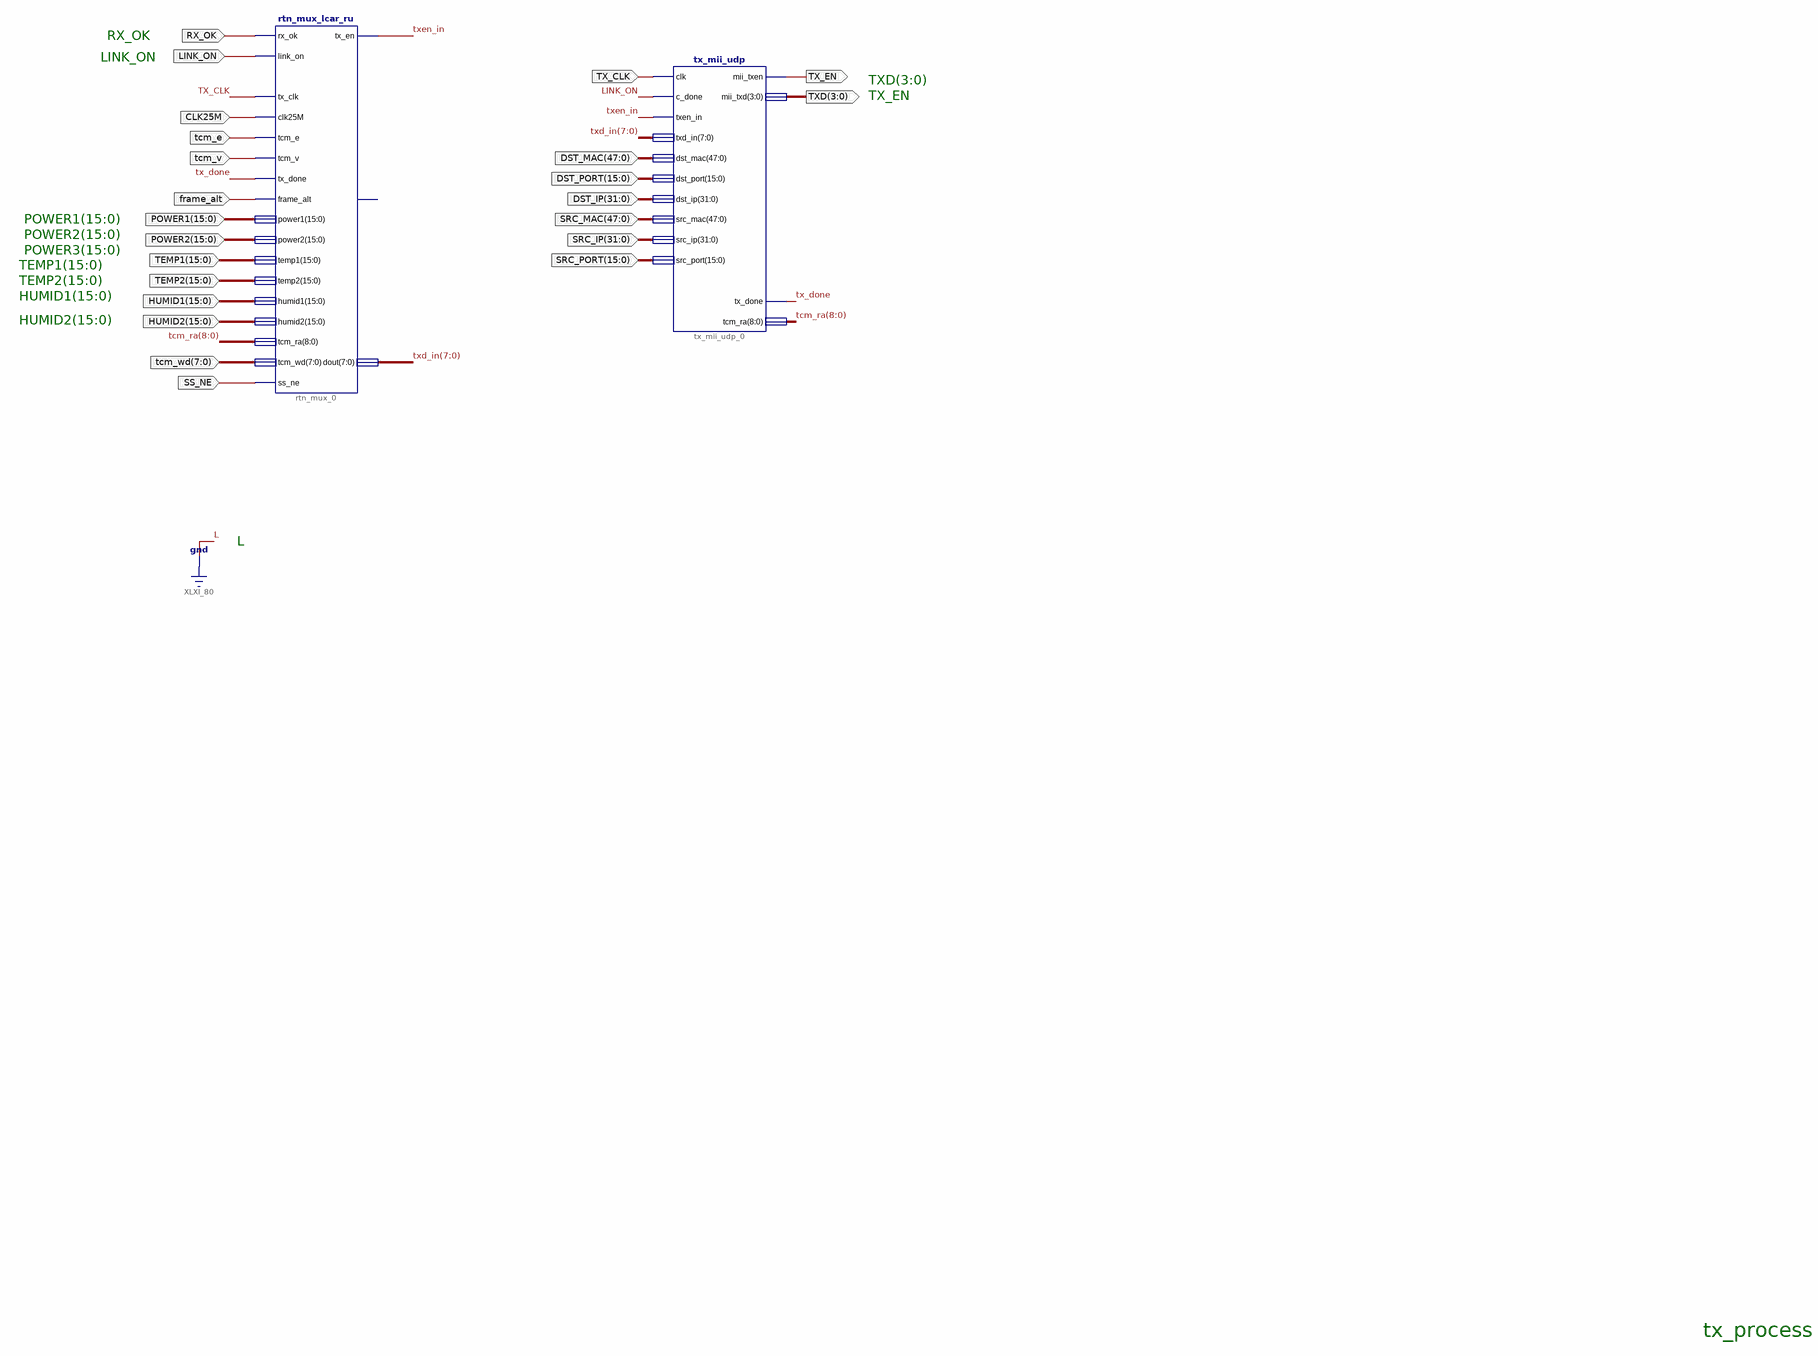
[diagram p0: schematic sheet 1]
// Xilinx ISE schematic tx_process.sch (aspartan6) as structural Verilog: 2 symbols, 23 ports
module tx_process (
  input  LINK_ON,
  input  TX_CLK,
  input  [47:0] DST_MAC,
  input  [15:0] DST_PORT,
  input  [31:0] DST_IP,
  input  [47:0] SRC_MAC,
  input  [31:0] SRC_IP,
  input  [15:0] SRC_PORT,
  input  [15:0] POWER1,
  input  RX_OK,
  input  CLK25M,
  input  [15:0] TEMP1,
  input  [15:0] TEMP2,
  input  [15:0] HUMID1,
  input  [15:0] HUMID2,
  input  tcm_e,
  input  tcm_v,
  input  frame_alt,
  input  [15:0] POWER2,
  input  [7:0] tcm_wd,
  input  SS_NE,
  output TX_EN,
  output [3:0] TXD
);

  wire tx_done, txen_in;
  wire [7:0] txd_in;
  wire [8:0] tcm_ra;

  tx_mii_udp tx_mii_udp_0 (
    .clk(TX_CLK), .c_done(LINK_ON), .txen_in(txen_in), .txd_in(txd_in), .dst_mac(DST_MAC),
    .dst_port(DST_PORT), .dst_ip(DST_IP), .src_mac(SRC_MAC), .src_ip(SRC_IP), .src_port(SRC_PORT),
    .mii_txen(TX_EN), .mii_txd(TXD), .tx_done(tx_done), .tcm_ra(tcm_ra));
  rtn_mux_lcar_ru rtn_mux_0 (
    .rx_ok(RX_OK), .link_on(LINK_ON), .tx_clk(TX_CLK), .clk25M(CLK25M), .tcm_e(tcm_e), .tcm_v(tcm_v),
    .tx_done(tx_done), .frame_alt(frame_alt), .power1(POWER1), .power2(POWER2), .temp1(TEMP1), .temp2(TEMP2),
    .humid1(HUMID1), .humid2(HUMID2), .tcm_ra(tcm_ra), .tcm_wd(tcm_wd), .tx_en(txen_in), .dout(txd_in),
    .ss_ne(SS_NE));  // open: tx_on

  // Notes on the sheet:
  //   RX_OK
  //   LINK_ON
  //   TXD(3:0)
  //   TX_EN
  //   POWER1(15:0)
  //   POWER2(15:0)
  //   POWER3(15:0)
  //   TEMP1(15:0)
  //   TEMP2(15:0)
  //   HUMID1(15:0)
  //   HUMID2(15:0)
  //   L
  //   tx_process
endmodule
